# Altium schematic sheet RAM.SchDoc
size A4
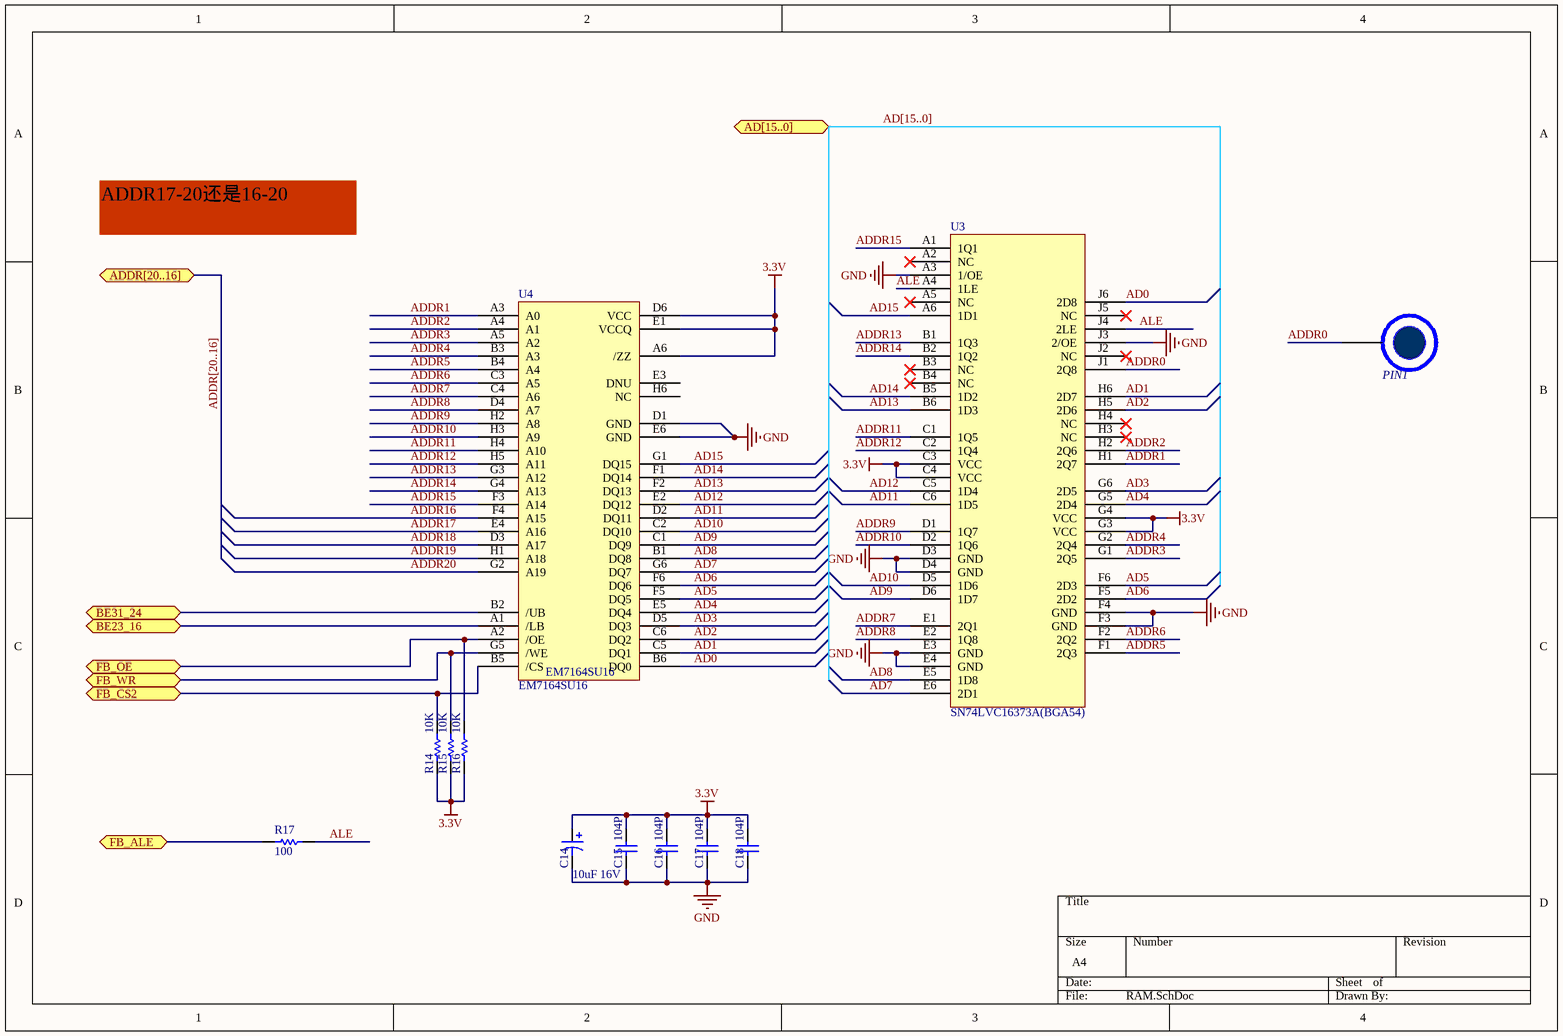
[diagram p0: RAM.SchDoc]

## Parts
C14  value 10uF 16V  [0402]  (hidden comment: Cap Pol1)
C15  value 104P  [0402]  (hidden comment: Cap)
C16  value 104P  [0402]  (hidden comment: Cap)
C17  value 104P  [0402]  (hidden comment: Cap)
C18  value 104P  [0402]  (hidden comment: Cap)
PIN1  PIN  [PIN]  (value not drawn)
R14  value 10K  [0402]  (hidden comment: Res)
R15  value 10K  [0402]  (hidden comment: Res)
R16  value 10K  [0402]  (hidden comment: Res)
R17  value 100  [0402]  (hidden comment: Res)
U3  SN74LVC16373A(BGA54)  [BGA54C80P6X9_550X800X120]
U4  EM7164SU16  [BGA48C75P6X8_598X698X104]

## Ports
AD[15..0], ADDR[20..16], BE23_16, BE31_24, FB_ALE, FB_CS2, FB_OE, FB_WR

## Nets
3.3V: C14.1 C15.2 C16.2 C17.2 C18.2 R14.2 R15.2 R16.2 U3.C3(VCC) U3.C4(VCC) U3.G3(VCC) U3.G4(VCC) U4.A6(/ZZ) U4.D6(VCC) U4.E1(VCCQ)
GND: C14.2 C15.1 C16.1 C17.1 C18.1 U3.A3(1/OE) U3.D3(GND) U3.D4(GND) U3.E3(GND) U3.E4(GND) U3.F3(GND) U3.F4(GND) U3.J3(2/OE) U4.D1(GND) U4.E6(GND)
AD0: U3.J6(2D8) U4.B6(DQ0)
AD1: U3.H6(2D7) U4.C5(DQ1)
AD2: U3.H5(2D6) U4.C6(DQ2)
AD3: U3.G6(2D5) U4.D5(DQ3)
AD4: U3.G5(2D4) U4.E5(DQ4)
AD5: U3.F6(2D3) U4.F5(DQ5)
AD6: U3.F5(2D2) U4.F6(DQ6)
AD7: U3.E6(2D1) U4.G6(DQ7)
AD8: U3.E5(1D8) U4.B1(DQ8)
AD9: U3.D6(1D7) U4.C1(DQ9)
AD10: U3.D5(1D6) U4.C2(DQ10)
AD11: U3.C6(1D5) U4.D2(DQ11)
AD12: U3.C5(1D4) U4.E2(DQ12)
AD13: U3.B6(1D3) U4.F2(DQ13)
AD14: U3.B5(1D2) U4.F1(DQ14)
AD15: U3.A6(1D1) U4.G1(DQ15)
ADDR0: PIN1.1(PIN) U3.J1(2Q8)
ADDR1: U3.H1(2Q7) U4.A3(A0)
ADDR2: U3.H2(2Q6) U4.A4(A1)
ADDR3: U3.G1(2Q5) U4.A5(A2)
ADDR4: U3.G2(2Q4) U4.B3(A3)
ADDR5: U3.F1(2Q3) U4.B4(A4)
ADDR6: U3.F2(2Q2) U4.C3(A5)
ADDR7: U3.E1(2Q1) U4.C4(A6)
ADDR8: U3.E2(1Q8) U4.D4(A7)
ADDR9: U3.D1(1Q7) U4.H2(A8)
ADDR10: U3.D2(1Q6) U4.H3(A9)
ADDR11: U3.C1(1Q5) U4.H4(A10)
ADDR12: U3.C2(1Q4) U4.H5(A11)
ADDR13: U3.B1(1Q3) U4.G3(A12)
ADDR14: U3.B2(1Q2) U4.G4(A13)
ADDR15: U3.A1(1Q1) U4.F3(A14)
ADDR16: U4.F4(A15)
ADDR17: U4.E4(A16)
ADDR18: U4.D3(A17)
ADDR19: U4.H1(A18)
ADDR20: U4.G2(A19)
ALE: R17.2 U3.A4(1LE) U3.J4(2LE)
BE23_16: U4.A1(/LB) ; port BE23_16
BE31_24: U4.B2(/UB) ; port BE31_24
FB_ALE: R17.1 ; port FB_ALE
FB_CS2: R14.1 U4.B5(/CS) ; port FB_CS2
FB_OE: R16.1 U4.A2(/OE) ; port FB_OE
FB_WR: R15.1 U4.G5(/WE) ; port FB_WR

Not connected (* = marked no-connect by the designer): U3 A2(NC)* A5(NC)* B3(NC)* B4(NC)* H3(NC)* H4(NC)* J2(NC)* J5(NC)*; U4 E3(DNU) H6(NC)

## Buses and harness runs
bus AD[15..0] = port AD[15..0]
bus ADDR[20..16] = port ADDR[20..16]

## Notes on the sheet
- ADDR17-20还是16-20

## Library data of the parts
C14 = Cap Pol1: Polarized Capacitor (Radial); Published: 8-Jun-2000; LatestRevisionDate: 17-Jul-2002; LatestRevisionNote: Re-released for DXP Platform.; PackageReference: RB7.6-15; Publisher: Altium Limited; PackageDescription: Polarized Capacitor (Radial); 2 Leads
C15-C18 = Cap: 贴片电容; Published: 8-Jun-2000; LatestRevisionDate: 17-Jul-2002; LatestRevisionNote: Re-released for DXP Platform.; PackageReference: RAD-0.3; Publisher: Altium Limited
R14-R17 = Res: 贴片电阻; Published: 8-Jun-2000; LatestRevisionDate: 17-Jul-2002; LatestRevisionNote: Re-released for DXP Platform.; PackageReference: AXIAL-0.3; Publisher: Altium Limited